# EAGLE schematic analogteil (EAGLE 4.15)
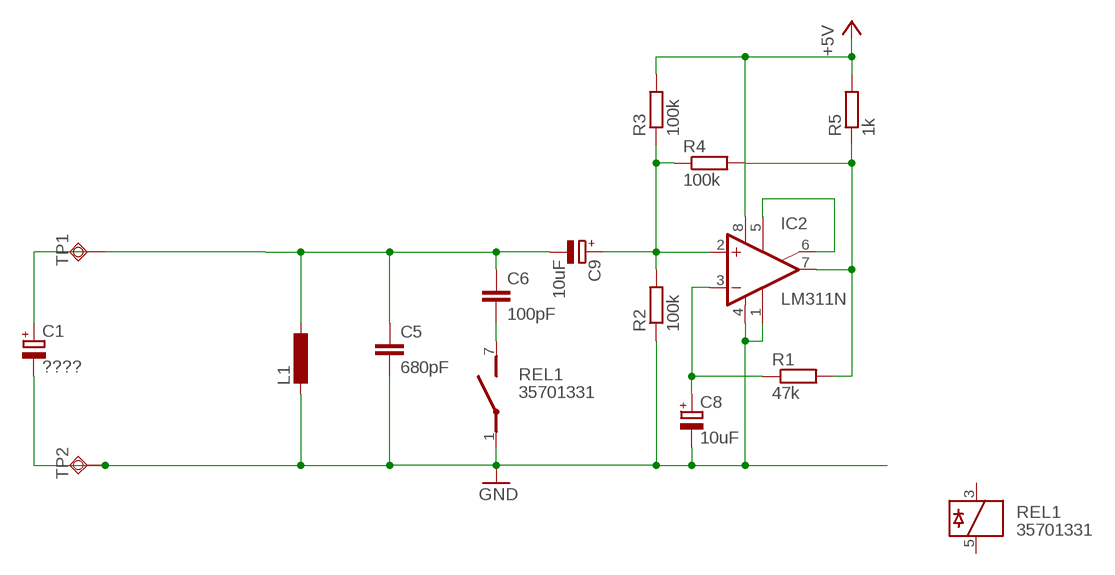
[diagram p0: schematic, sheet 1]

## Parts
C1  ????  CPOL-EUE2.5-5  [E2,5-5]
C5  680pF  C-EU025-030X050  [C025-030X050]
C6  100pF  C-EU025-030X050  [C025-030X050]
C8  10uF  CPOL-EUE2.5-5  [E2,5-5]
C9  10uF  CPOL-EUE2.5-5  [E2,5-5]
IC2  LM311N  [DIL08]
L1  L-EU0207/10  [0207/10]
R1  47k  R-EU_0207/7  [0207/7]
R2  100k  R-EU_0207/7  [0207/7]
R3  100k  R-EU_0207/7  [0207/7]
R4  100k  R-EU_0207/7  [0207/7]
R5  1k  R-EU_0207/7  [0207/7]
REL1  35701331  [REED]
TP1  TPSQPAD1-20Y  [P1-20Y]
TP2  TPSQPAD1-20Y  [P1-20Y]

## Nets
+5V: IC2.8(V+) R3.2 R5.2
GND: C1.- C5.2 C8.- IC2.1(GND) IC2.4(V-) L1.2 R2.1 REL1.1(2:P) TP2.1(TP)
N$2: C1.+
N$5: IC2.5(ON) IC2.6(ON/STR)
N$7: IC2.7(OUT) R1.2 R4.2 R5.1
N$8: C8.+ IC2.3(-IN) R1.1
N$9: C6.2 REL1.7(2:S)
N$10: C9.+ IC2.2(+IN) R2.2 R3.1 R4.1
N$11: C5.1 C6.1 C9.- L1.1
N$12: TP1.1(TP)
Unconnected: REL1.3 REL1.5

## Library data of the parts
C1 C8 C9 = rcl:CPOL-EU: POLARIZED CAPACITOR, European symbol
C5 C6 = rcl:C-EU: CAPACITOR, European symbol
IC2 = linear:LM311: COMPARATOR
L1 = rcl:L-EU: INDUCTOR, European symbol
R1-R5 = rcl:R-EU_: RESISTOR, European symbol
REL1 = relay:35701331: RELAY reed, 1 x norm. open with polarity
TP1 TP2 = testpad:TPSQ